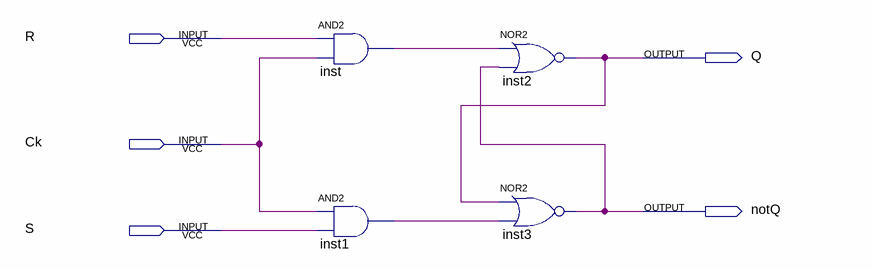
[diagram p0: schematic sheet]
// Quartus schematic RSlec.bdf as structural Verilog: 4 symbols, 5 pins
module RSlec (
  input  R,
  input  Ck,
  input  S,
  output Q,
  output notQ
);

  wire inst1_out, inst_out;

  and inst (inst_out, R, Ck);
  and inst1 (inst1_out, Ck, S);
  nor inst2 (Q, inst_out, notQ);
  nor inst3 (notQ, Q, inst1_out);
endmodule
